# Altium schematic sheet 红外热成像V1.SchDoc
size A4
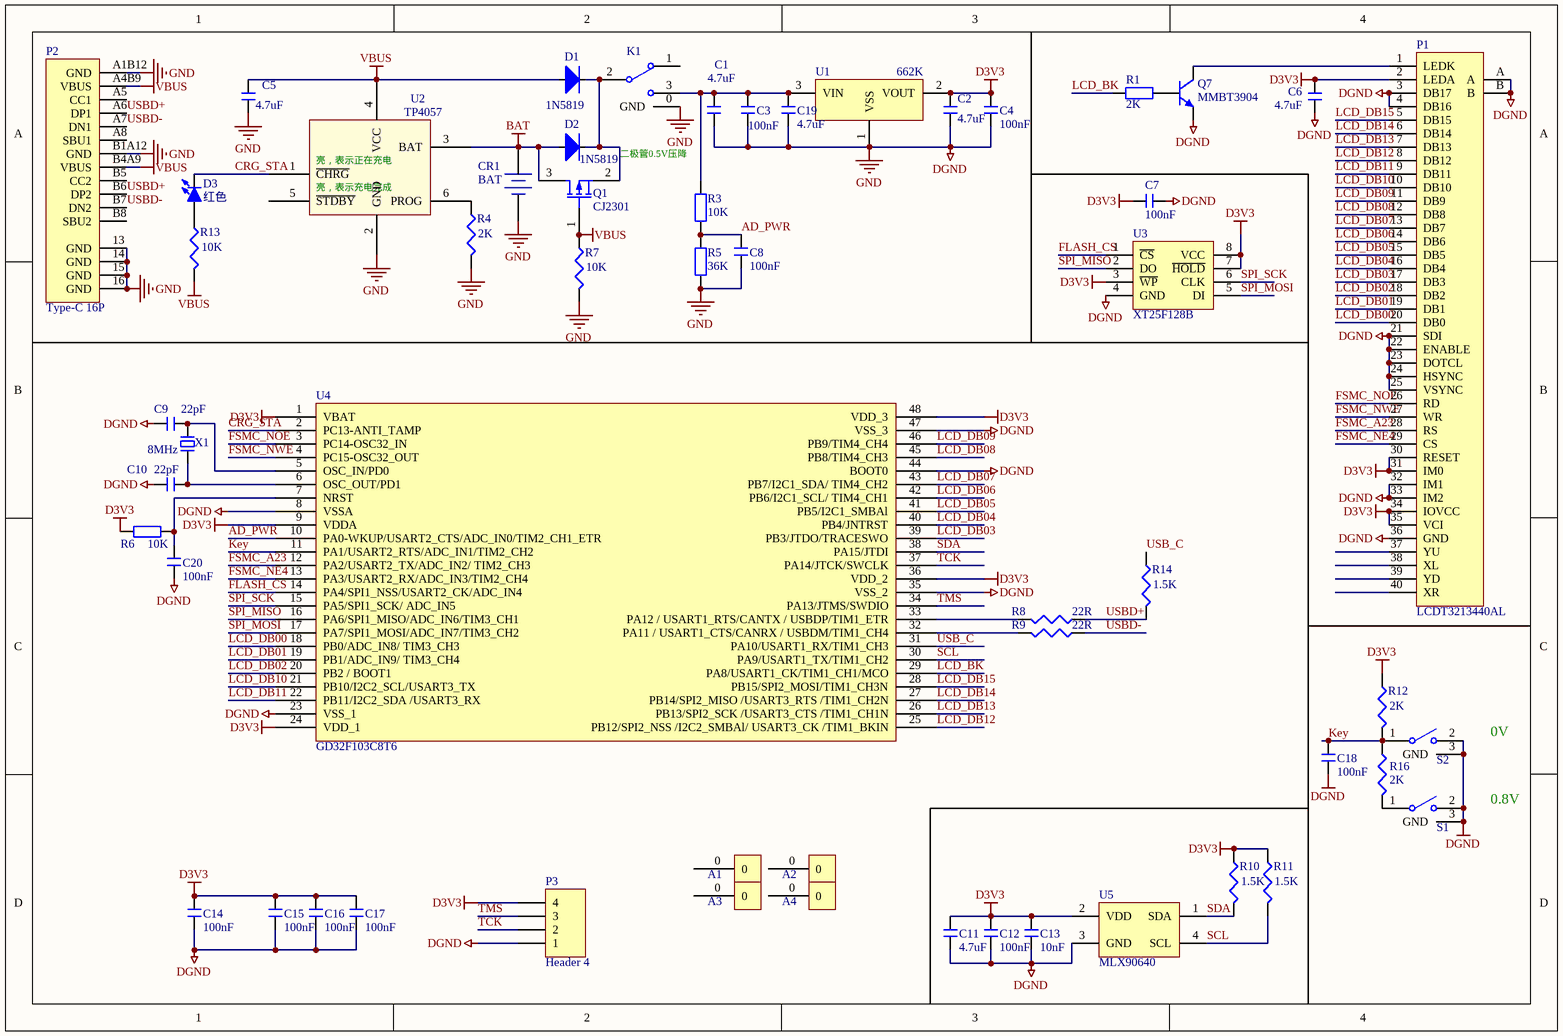
[diagram p0: 红外热成像V1.SchDoc]

## Parts
A1  安装孔  [安装孔]  (value not drawn)
A2  安装孔  [安装孔]  (value not drawn)
A3  安装孔  [安装孔]  (value not drawn)
A4  安装孔  [安装孔]  (value not drawn)
C1  4.7uF  [C0603]
C2  4.7uF  [C0603]
C3  100nF  [C0603]
C4  100nF  [C0603]
C5  4.7uF  [C0603]
C6  4.7uF  [C0603]
C7  100nF  [C0603]
C8  100nF  [C0603]
C9  22pF  [C0603]
C10  22pF  [C0603]
C11  4.7uF  [C0603]
C12  100nF  [C0603]
C13  10nF  [C0603]
C14  100nF  [C0603]
C15  100nF  [C0603]
C16  100nF  [C0603]
C17  100nF  [C0603]
C18  100nF  [C0603]
C19  4.7uF  [C0603]
C20  100nF  [C0603]
CR1  BAT  [BAT]
D1  1N5819  [SOD123]
D2  1N5819  [SOD123]
D3  红色  [D0805]
K1  SS-12F23  [3P SW]  (value not drawn)
P1  LCDT3213440AL  [LCDT3213440AL]
P2  Type-C 16P  [Type-C 16P]
P3  Header 4  [4PIN-1.27-STLink]
Q1  CJ2301  [SOT-23]
Q7  MMBT3904  [SOT23-3L]
R1  2K  [R0603]
R3  10K  [R0603]
R4  2K  [R0603]
R5  36K  [R0603]
R6  10K  [R0603]
R7  10K  [R0603]
R8  22R  [R0603]
R9  22R  [R0603]
R10  1.5K  [R0603]
R11  1.5K  [R0603]
R12  2K  [R0603]
R13  10K  [R0603]
R14  1.5K  [R0603]
R16  2K  [R0603]
S1  KCD1-101  [3P-Key]  (value not drawn)
S2  KCD1-101  [3P-Key]  (value not drawn)
U1  662K  [SOT-23]
U2  TP4057  [SOT23-6]
U3  XT25F128B  [SOP8W_N]
U4  GD32F103C8T6  [LQFP_48]
U5  MLX90640  [MLX90640]
X1  8MHz  [XSR - duplicate]

## Nets
BAT: CR1.1(DC+) D2.1(A) Q1.3(D) U2.3(BAT)
D3V3: C2.1 C4.2 C6.2 C7.2 C11.1 C12.2 C13.2 C14.2 C15.2 C16.2 C17.2 P1.2(LEDA) P1.30(RESET) P1.31(IM0) P1.34(IOVCC) P1.35(VCI) P3.4 R6.2 R10.2 R11.2 R12.2 U1.2(VOUT) U3.3(~{WP}) U3.7(~{HOLD}) U3.8(VCC) U4.1(VBAT) U4.9(VDDA) U4.24(VDD_1) U4.36(VDD_2) U4.48(VDD_3) U5.2(VDD)
DGND: C1.2 C2.2 C3.1 C4.1 C5.2 C6.1 C7.1 C8.1 C9.1 C10.1 C11.2 C12.1 C13.1 C14.1 C15.1 C16.1 C17.1 C18.1 C19.1 C20.2 CR1.2(DC-) K1.0(GND) P1.3(DB17) P1.4(DB16) P1.21(SDI) P1.22(ENABLE) P1.23(DOTCL) P1.24(HSYNC) P1.25(VSYNC) P1.32(IM1) P1.33(IM2) P1.36(GND) P1.A P1.B P2.13(GND) P2.14(GND) P2.15(GND) P2.16(GND) P2.A1B12(GND) P2.B1A12(GND) P3.1 Q7.2(E) R4.1 R5.1 R7.1 S1.2 S1.3(GND) S2.2 S2.3(GND) U1.1(VSS) U2.2(GND) U3.4(GND) U4.8(VSSA) U4.23(VSS_1) U4.35(VSS_2) U4.44(BOOT0) U4.47(VSS_3) U5.3(GND)  [also labelled GND]
VBUS: C5.1 D1.1(A) P2.A4B9(VBUS) P2.B4A9(VBUS) Q1.1(G) R7.2 R13.1 U2.4(VCC)
AD_PWR: C8.2 R3.1 R5.2 U4.10(PA0-WKUP/USART2_CTS/ADC_IN0/TIM2_CH1_ETR)
CRG_STA: D3.2(K) U2.1(~{CHRG}) U4.2(PC13-ANTI_TAMP)
FLASH_CS: U3.1(~{CS}) U4.14(PA4/SPI1_NSS/USART2_CK/ADC_IN4)
FSMC_A23: P1.28(RS) U4.12(PA2/USART2_TX/ADC_IN2/_TIM2_CH3)
FSMC_NE4: P1.29(CS) U4.13(PA3/USART2_RX/ADC_IN3/TIM2_CH4)
FSMC_NOE: P1.26(RD) U4.3(PC14-OSC32_IN)
FSMC_NWE: P1.27(WR) U4.4(PC15-OSC32_OUT)
Key: C18.2 R12.1 R16.2 S2.1 U4.11(PA1/USART2_RTS/ADC_IN1/TIM2_CH2)
LCD_BK: R1.2 U4.29(PA8/USART1_CK/TIM1_CH1/MCO)
LCD_DB00: P1.20(DB0) U4.18(PB0/ADC_IN8/_TIM3_CH3)
LCD_DB01: P1.19(DB1) U4.19(PB1/ADC_IN9/_TIM3_CH4)
LCD_DB02: P1.18(DB2) U4.20(PB2_/_BOOT1)
LCD_DB03: P1.17(DB3) U4.39(PB3/JTDO/TRACESWO)
LCD_DB04: P1.16(DB4) U4.40(PB4/JNTRST)
LCD_DB05: P1.15(DB5) U4.41(PB5/I2C1_SMBAl)
LCD_DB06: P1.14(DB6) U4.42(PB6/I2C1_SCL/_TIM4_CH1)
LCD_DB07: P1.13(DB7) U4.43(PB7/I2C1_SDA/_TIM4_CH2)
LCD_DB08: P1.12(DB8) U4.45(PB8/TIM4_CH3)
LCD_DB09: P1.11(DB9) U4.46(PB9/TIM4_CH4)
LCD_DB10: P1.10(DB10) U4.21(PB10/I2C2_SCL/USART3_TX)
LCD_DB11: P1.9(DB11) U4.22(PB11/I2C2_SDA_/USART3_RX)
LCD_DB12: P1.8(DB12) U4.25(PB12/SPI2_NSS_/I2C2_SMBAl/_USART3_CK_/TIM1_BKIN)
LCD_DB13: P1.7(DB13) U4.26(PB13/SPI2_SCK_/USART3_CTS_/TIM1_CH1N)
LCD_DB14: P1.6(DB14) U4.27(PB14/SPI2_MISO_/USART3_RTS_/TIM1_CH2N)
LCD_DB15: P1.5(DB15) U4.28(PB15/SPI2_MOSI/TIM1_CH3N)
SCL: R11.1 U4.30(PA9/USART1_TX/TIM1_CH2) U5.4(SCL)
SDA: R10.1 U4.38(PA15/JTDI) U5.1(SDA)
SPI_MISO: U3.2(DO) U4.16(PA6/SPI1_MISO/ADC_IN6/TIM3_CH1)
SPI_MOSI: U3.5(DI) U4.17(PA7/SPI1_MOSI/ADC_IN7/TIM3_CH2)
SPI_SCK: U3.6(CLK) U4.15(PA5/SPI1_SCK/_ADC_IN5)
TCK: P3.2 U4.37(PA14/JTCK/SWCLK)
TMS: P3.3 U4.34(PA13/JTMS/SWDIO)
USB_C: R14.2 U4.31(PA10/USART1_RX/TIM1_CH3)
USBD+: P2.A6(DP1) P2.B6(DP2) R8.2 R14.1
USBD-: P2.A7(DN1) P2.B7(DN2) R9.2
NetC1_1: C1.1 C3.2 C19.2 K1.3 R3.2 U1.3(VIN)
NetC9_2: C9.2 U4.5(OSC_IN/PD0) X1.1
NetC10_2: C10.2 U4.6(OSC_OUT/PD1) X1.2
NetC20_1: C20.1 R6.1 U4.7(NRST)
NetD1_2: D1.2(K) D2.2(K) K1.2 Q1.2(S)
NetD3_1: D3.1(A) R13.2
NetP1_1: P1.1(LEDK) Q7.3(C)
NetQ7_1: Q7.1(B) R1.1
NetR4_2: R4.2 U2.6(PROG)
NetR8_1: R8.1 U4.33(PA12_/_USART1_RTS/CANTX_/_USBDP/TIM1_ETR)
NetR9_1: R9.1 U4.32(PA11_/_USART1_CTS/CANRX_/_USBDM/TIM1_CH4)
NetR16_1: R16.1 S1.1

Not connected (* = marked no-connect by the designer): A1 0; A2 0; A3 0; A4 0; K1 1; P1 37(YU) 38(XL) 39(YD) 40(XR); P2 A5(CC1) A8(SBU1) B5(CC2) B8(SBU2); U2 5(~{STDBY})

## Notes on the sheet
- (near U2) 亮，表示正在充电
- 二极管0.5V压降
- (near U2) 亮，表示充电完成
- 0V
- 0.8V

## Library data of the parts
C1-C20 = C: CAP; BOM名称: 无极性贴片电容; 版权归属: 源创客; 材质: X7R; 学习资源: www.ooocke.com
CR1 = CR-3V: 锂电池; BOM名称: 微型电池; 版权归属: 源创客; 学习资源: www.ooocke.com
D1 D2 = Diode: 二极管_整流; Published: 8-Jun-2000; LatestRevisionDate: 17-Jul-2002; LatestRevisionNote: Re-released for DXP Platform.; PackageDocument: Sep-1996; PackageReference: SMC; Publisher: Altium Limited; Code_JEDEC: DO-214-AB
D3 = LED-SMD: 贴片LED; 版权归属: 源创客; BOM名称: 贴片LED; 学习资源: www.ooocke.com
K1 = SSW-1P: 开关; BOM名称: 波动开关; 版权归属: 源创客; 学习资源: www.ooocke.com
P1 = LCDT3213440AL: 接插件
P2 = Type-C 16P: 接插件
P3 = Header 4: Header, 4-Pin; LatestRevisionDate: 17-Jul-2002; LatestRevisionNote: Re-released for DXP Platform.; Publisher: Altium Limited
Q1 = MOSFET-P: MOS; Published: 8-Jun-2000; LatestRevisionDate: 17-Jul-2002; LatestRevisionNote: Re-released for DXP Platform.; PackageVersion: 1995/1996; PackageReference: E3; Publisher: Altium Limited; PackageDescription: TO, Flat Index; 3 In-Line, Axial Leads; Body Dia. 4.6mm; Lead Dia. 0.5 mm (max)
Q7 = 9013-SMD: 三极管; BOM名称: 低频放大-NPN型; 版权归属: 源创客; 属性: 50V 0.5A 0.625W; 学习资源: www.ooocke.com
R1 = RSSR0603: RES
R3 R5 R6 = R-Precision: RES; BOM名称: 精密电阻; 版权归属: 源创客; 学习资源: www.ooocke.com
R4 R7-R14 R16 = RES
S1 S2 = KCD1-101: 按键; BOM名称: 1路单刀船型开关; 版权归属: 源创客; 学习资源: www.ooocke.com
U1 = 662K: 芯片
U2 = Component_1: 芯片
U3 = W25Qxx: 芯片; BOM名称: 外置Flash; 版权归属: 源创客; 学习资源: www.ooocke.com
U4 = STM32F103CX: 芯片
U5 = MLX90460: 芯片
X1 = XTAL-2P: 晶振; BOM名称: 2脚无源脚晶振; 版权归属: 源创客; 负载电容: CL20pF; 学习资源: www.ooocke.com